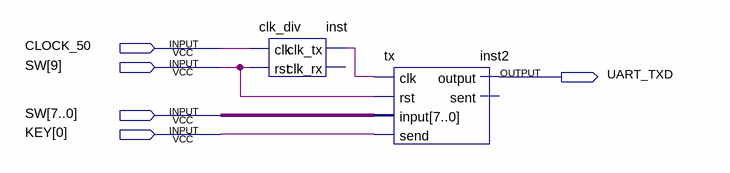
[diagram p0: schematic sheet]
// Quartus schematic tx_test.bdf as structural Verilog: 2 symbols, 5 pins
module tx_test (
  input  CLOCK_50,
  input  [9:0] SW,
  input  [0:0] KEY,
  output UART_TXD
);

  wire inst_clk_tx;

  clk_div inst (.clk(CLOCK_50), .rst(SW[9]), .clk_tx(inst_clk_tx));  // open: clk_rx
  tx inst2 (.clk(inst_clk_tx), .rst(SW[9]), .\input (SW[7:0]), .send(KEY[0]), .\output (UART_TXD));  // open: sent
endmodule
